# EasyEDA Pro project UARTAI.eprj

# Schematic UARTAI

## Sheets
1 Power: Create Date: 2025-04-27; Page Name: Power; Project Name: UARTAI; Schematic Name: UARTAI; Update Date: 2025-04-28; Company: geek-logic.com; Page Size: A4; Version: V1.0
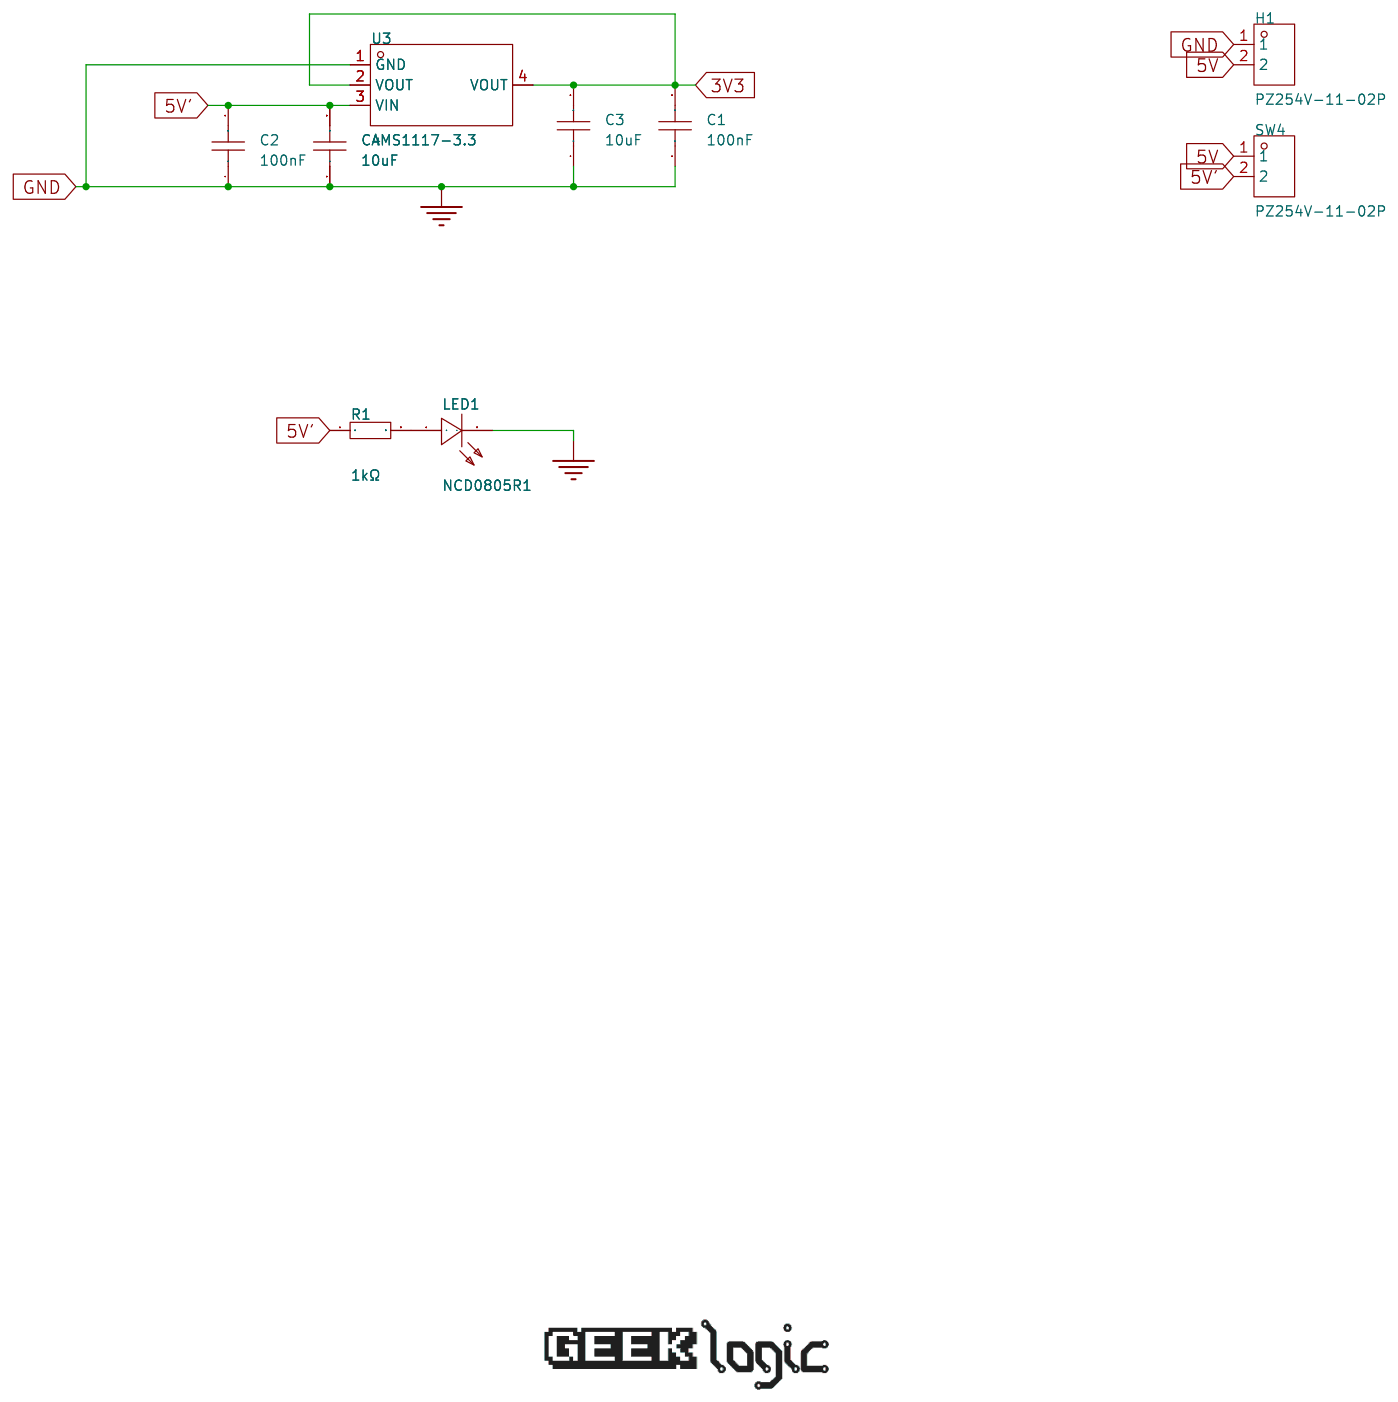
[diagram p0: Power]
2 MCU: Board Name: Board1; Page Name: MCU
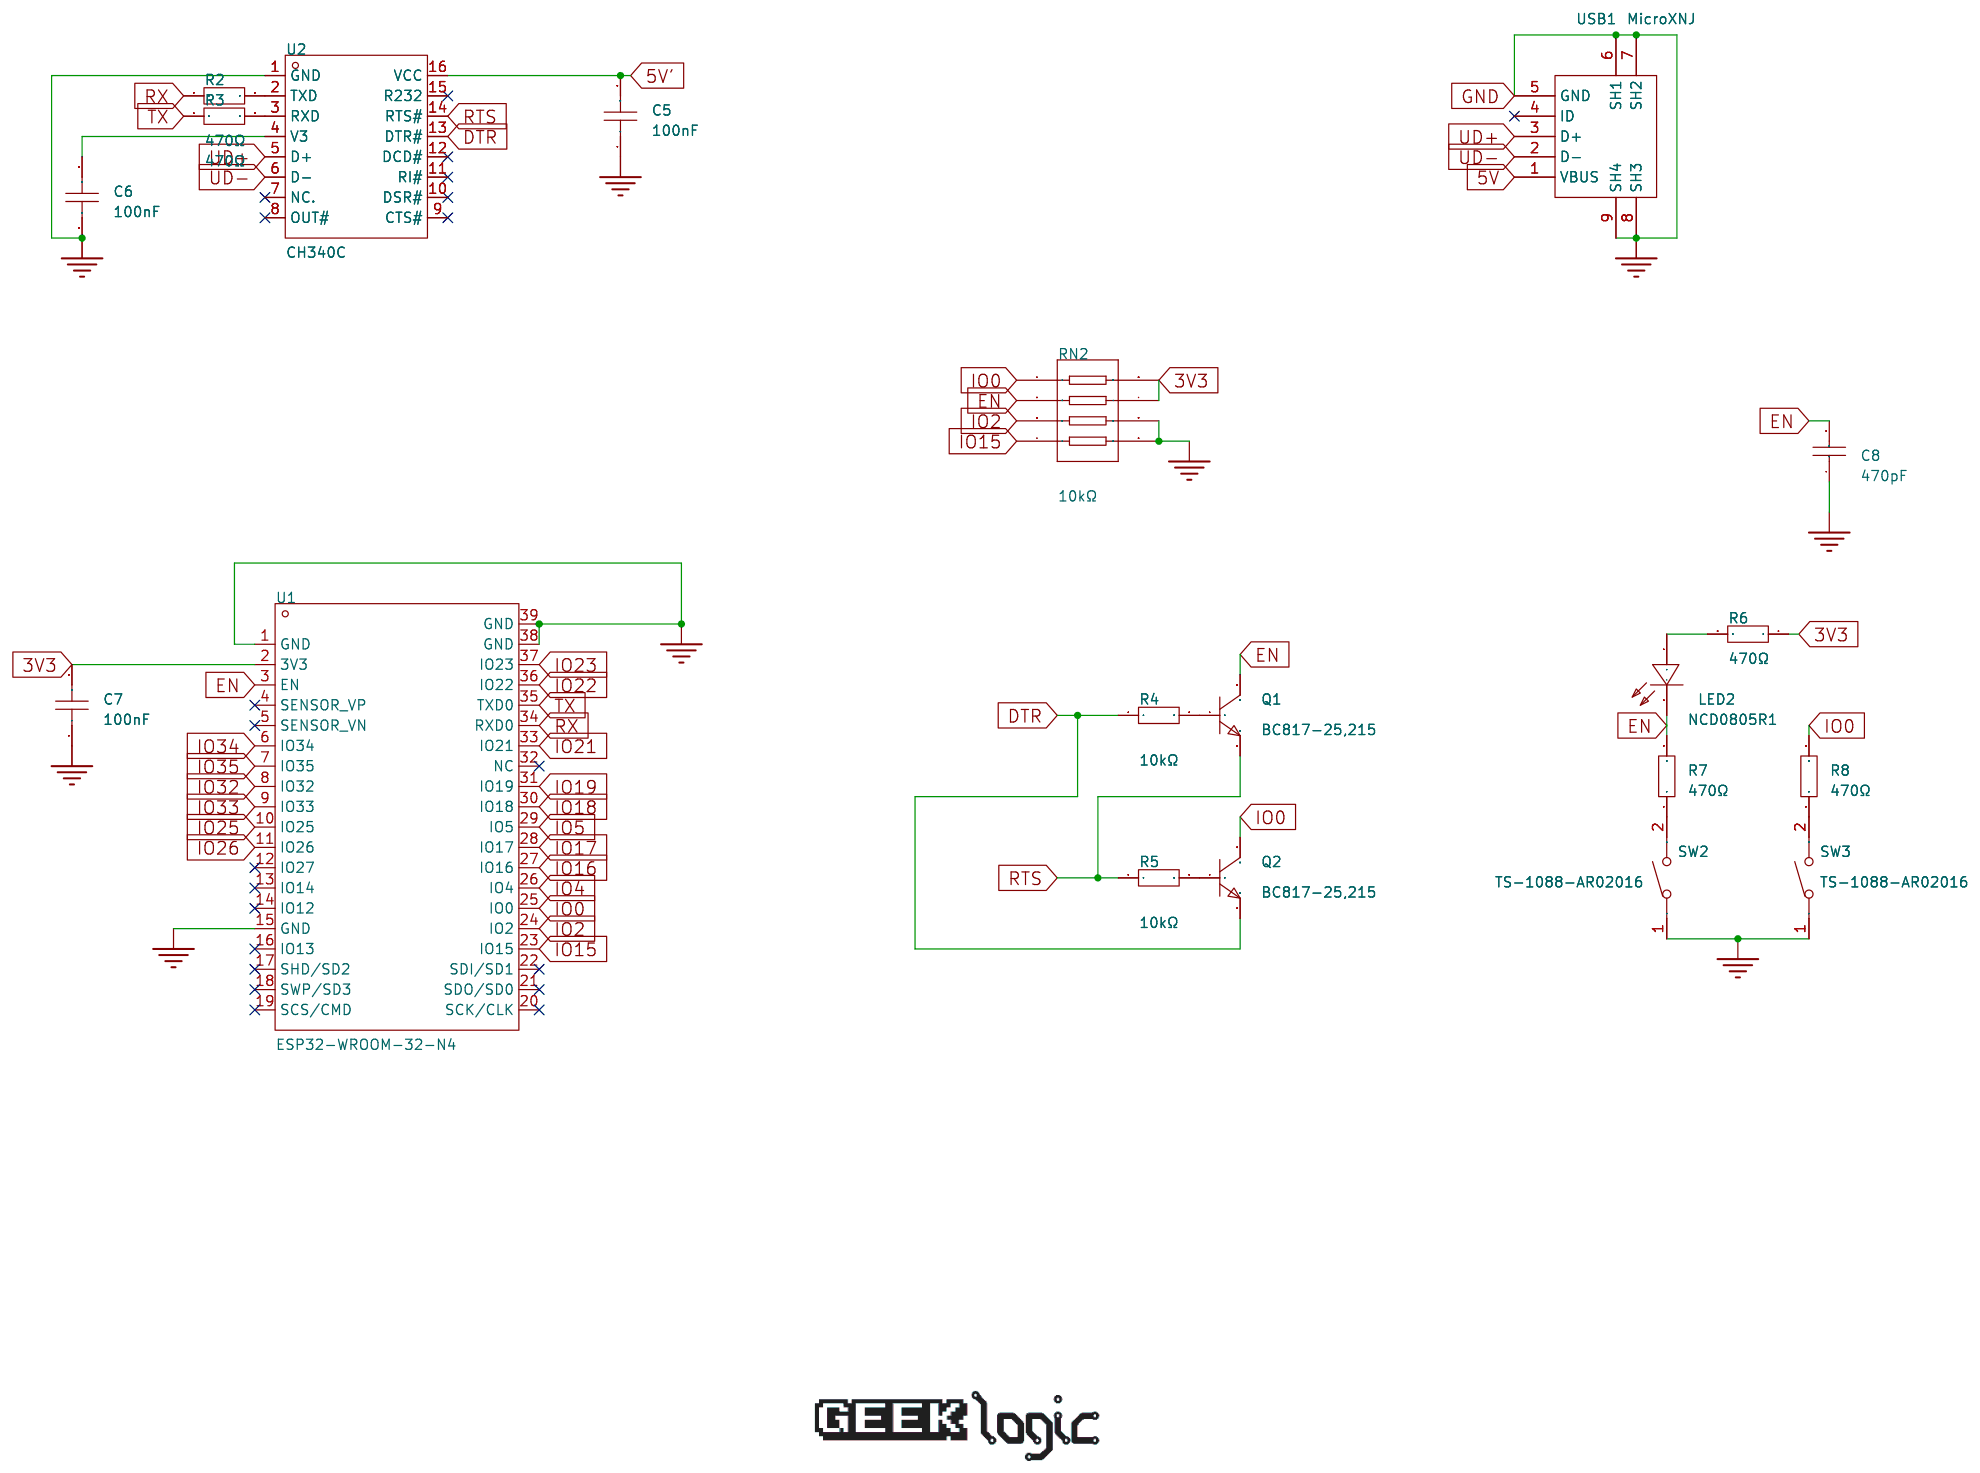
[diagram p1: MCU]
3 RS232: Board Name: Board1; Page Name: RS232; Company: 嘉立创EDA
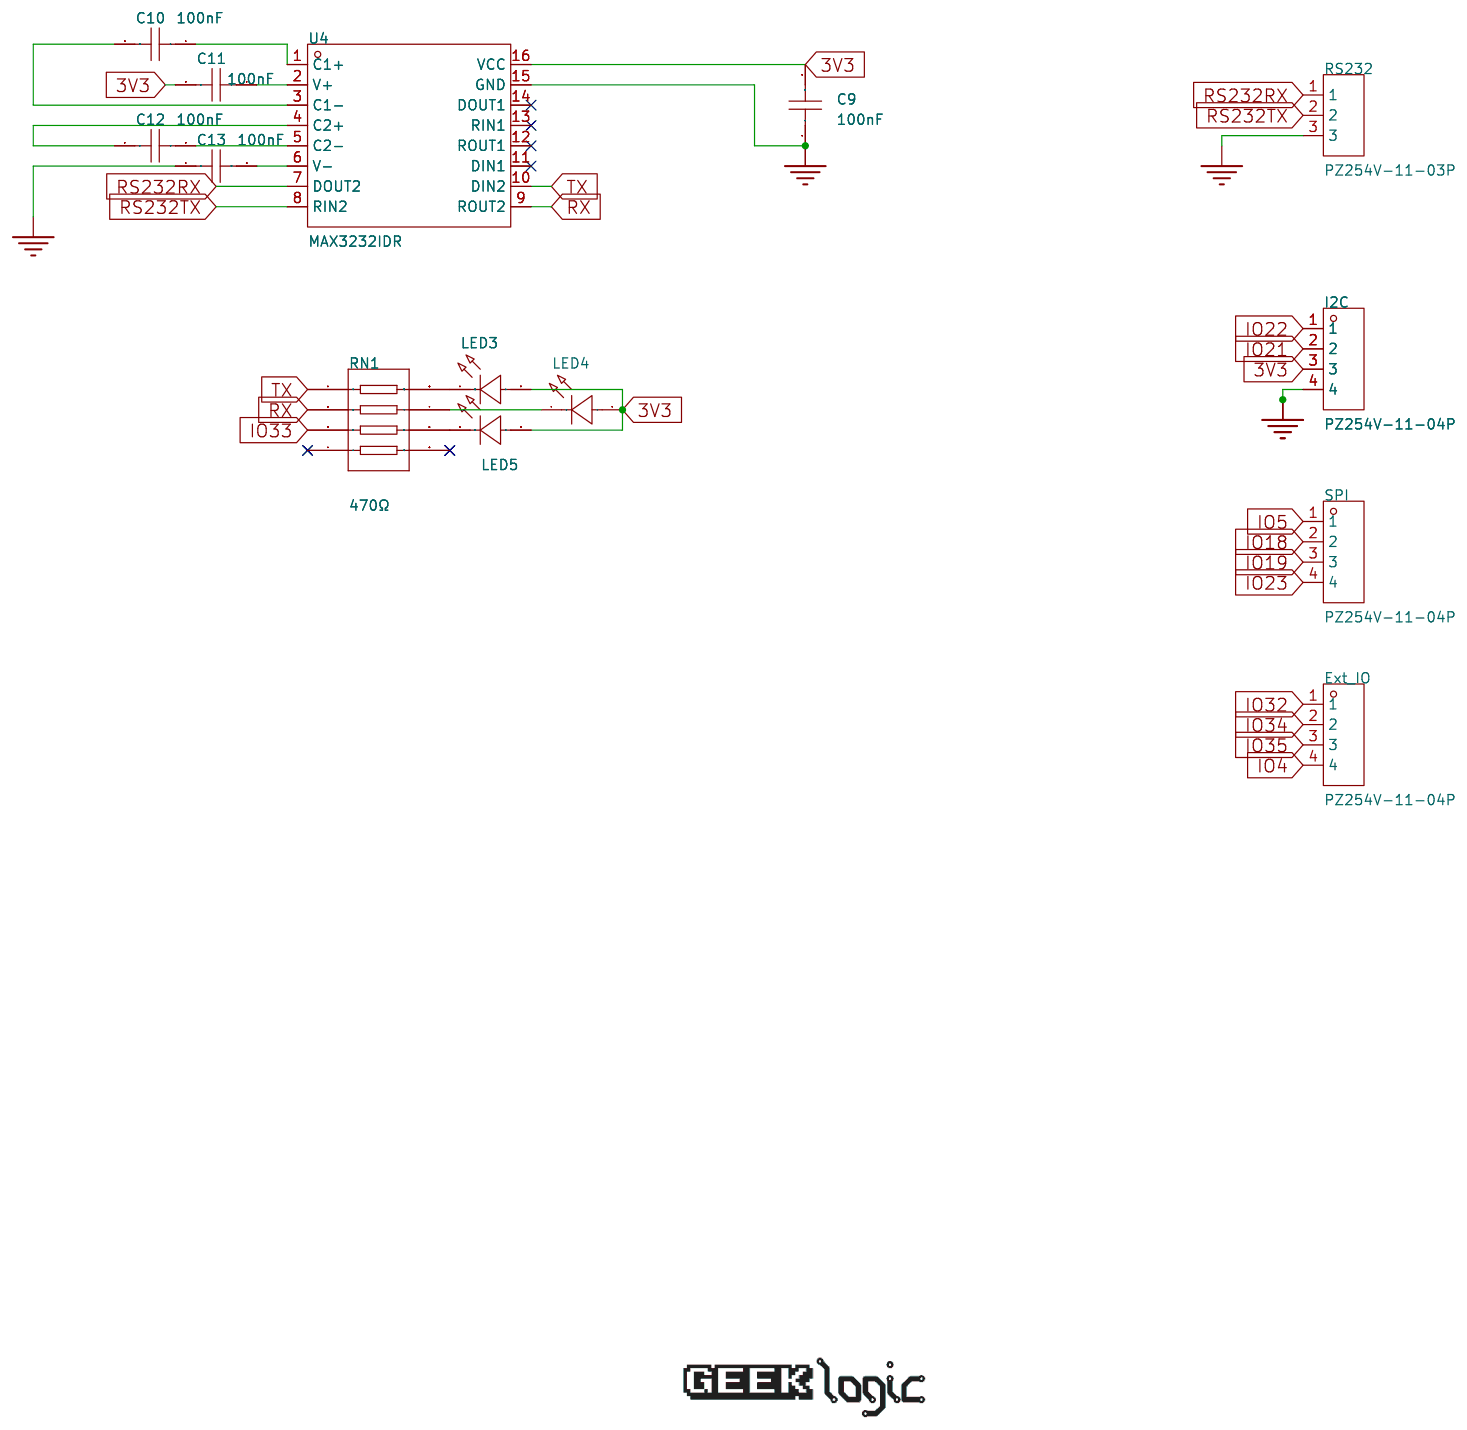
[diagram p2: RS232]

## Parts
sheet MCU
C5  100nF  [C0805]
C6  100nF  [C0805]
C7  100nF  [C0805]
C8  470pF  [C0805]
LED2  NCD0805R1  [LED0805-R-RD]
Q1  BC817-25,215  [SOT-23-3_L2.9-W1.6-P1.90-LS2.8-BR]
Q2  BC817-25,215  [SOT-23-3_L2.9-W1.6-P1.90-LS2.8-BR]
R2  470Ω  [R0805]
R3  470Ω  [R0805]
R4  10kΩ  [R0805]
R5  10kΩ  [R0805]
R6  470Ω  [R0805]
R7  470Ω  [R0805]
R8  470Ω  [R0805]
RN2  10kΩ  [RES-ARRAY-SMD_0603-8P-L3.2-W1.6-BL]
SW2  TS-1088-AR02016  [SW-SMD_L3.9-W3.0-P4.45]
SW3  TS-1088-AR02016  [SW-SMD_L3.9-W3.0-P4.45]
U1  ESP32-WROOM-32-N4  [WIFIM-SMD_ESP32-WROOM-32-N4]
U2  CH340C  [SOP-16_L10.0-W3.9-P1.27-LS6.0-BL]
USB1  MicroXNJ  [MICRO-USB-SMD_MICROXNJ]
sheet Power
C1  100nF  [C0805]
C2  100nF  [C0805]
C3  10uF  [C0805]
C4  10uF  [C0805]
H1  PZ254V-11-02P  [HDR-TH_2P-P2.54-V-M]
LED1  NCD0805R1  [LED0805-R-RD]
R1  1kΩ  [R0805]
SW4  PZ254V-11-02P  [HDR-TH_2P-P2.54-V-M]
U3  AMS1117-3.3  [SOT-223-3_L6.5-W3.4-P2.30-LS7.0-BR]
sheet RS232
C9  100nF  [C0805]
C10  100nF  [C0805]
C11  100nF  [C0805]
C12  100nF  [C0805]
C13  100nF  [C0805]
Ext_IO  PZ254V-11-04P  [HDR-TH_4P-P2.54-V-M]
I2C  PZ254V-11-04P  [HDR-TH_4P-P2.54-V-M]
LED3  SLR-342MG3F  [LED-TH_BD3.8-P2.54-RD]
LED4  SLR-342MG3F  [LED-TH_BD3.8-P2.54-RD]
LED5  SLR-342MG3F  [LED-TH_BD3.8-P2.54-RD]
RN1  470Ω  [RES-ARRAY-SMD_0603-8P-L3.2-W1.6-BL]
RS232  PZ254V-11-03P  [HDR-TH_3P-P2.54-V-M]
SPI  PZ254V-11-04P  [HDR-TH_4P-P2.54-V-M]
U4  MAX3232IDR  [SOIC-16_L9.9-W3.9-P1.27-LS6.0-BL]

## Library data of the parts
C1 C2 C5-C7 = CC0805KRX7R9BB104: LCSC Part Name: 100nF ±10% 50V; Supplier Part: C49678; Manufacturer: YAGEO(国巨); Supplier Footprint: 0805; JLCPCB Part Class: 基础库; Datasheet: https://atta.szlcsc.com/upload/public/pdf/source/20180224/C181747_15194369449651363981.pdf; Supplier: LCSC; Tolerance: ±10%; Voltage Rated: 50V; Temperature Coefficient: X7R; Check: true
C8 = 0805B471K500NT: 容值:470pF;精度:±10%;额定电压:50V;材质(温度系数):X7R;; LCSC Part Name: 470pF ±10% 50V; Supplier Part: C1743; Manufacturer: FH(风华); Supplier Footprint: 0805; JLCPCB Part Class: 基础库; Datasheet: https://atta.szlcsc.com/upload/public/pdf/source/20200305/C486355_26A10D38EF8C2A5C37091D0039909270.pdf; Supplier: LCSC; Tolerance: ±10%; Voltage Rated: 50V; Temperature Coefficient: X7R; Check: true
LED1 LED2 = NCD0805R1: Supplier Part: C84256; Manufacturer: 国星光电; Supplier Footprint: 0805; JLCPCB Part Class: 基础库; Datasheet: https://atta.szlcsc.com/upload/public/pdf/source/20200820/C84256_F0A75A43B3EAD75808600A0514C76B99.pdf; Supplier: LCSC; Emitted Color: 红色; Forward Voltage (VF): 1.6V~2.6V; Power Dissipation: 65mW; Forward Current: 20mA; Dominant Wavelength: 615nm~630nm; Diode Configuration: 独立二极管; Lens Color: 无色透明透镜; Luminous Intensity: 67mcd~195mcd; Viewing Angle: 130°; Operating Temperature: -30℃~+85℃; Check: true
Q1 Q2 = BC817-25,215: 晶体管类型:NPN;集电极电流(Ic):500mA;集射极击穿电压(Vceo):45V;功率(Pd):345mW;直流电流增益(hFE@Ic,Vce):160@100mA,1V;; LCSC Part Name: NPN 电流:500mA 耐压:45V hfe=160~400; Supplier Part: C39828; Manufacturer: Nexperia(安世); Supplier Footprint: SOT-23; JLCPCB Part Class: 扩展库; Datasheet: https://atta.szlcsc.com/upload/public/pdf/source/20230809/66EBCDF15581E5AD3889B2C47A4438C7.pdf; Supplier: LCSC; Transistor Type: NPN; Collector Current (Ic): 500mA; Collector-Emitter Breakdown Voltage (Vceo): 45V; Power Dissipation (Pd): 345mW; DC Current Gain (hFE@Ic,Vce): 160@100mA,1V; Transition Frequency (fT): 100MHz; Collector Cut-Off Current (Icbo): 100nA; Collector-Emitter Saturation Voltage (VCE(sat)@Ic,Ib): 700mV@500mA,50mA; Operating Temperature: -65℃~+150℃; Check: true
R2 R3 R6-R8 = 0805W8F4700T5E: 电阻类型:厚膜电阻;阻值:470Ω;精度:±1%;功率:125mW;最大工作电压:150V;温度系数:±100ppm/℃;; LCSC Part Name: 470Ω ±1% 125mW 厚膜电阻; Supplier Part: C17710; Manufacturer: UNI-ROYAL(厚声); Supplier Footprint: 0805; JLCPCB Part Class: 基础库; Datasheet: https://atta.szlcsc.com/upload/public/pdf/source/20200306/C422600_1E6D84923E4A46A82E41ADD87F860B5C.pdf; Supplier: LCSC; Type: 厚膜电阻; Tolerance: ±1%; Power(Watts): 125mW; Overload Voltage (Max): 150V; Temperature Coefficient: ±100ppm/℃; Operating Temperature Range: -55℃~+155℃; Check: true
R4 R5 = 0805W8F1002T5E_C17414: LCSC Part Name: 10kΩ ±1% 125mW 厚膜电阻; Supplier Part: C17414; Manufacturer: UNI-ROYAL(厚声); Manufacturer Part: 0805W8F1002T5E; Supplier Footprint: 0805; JLCPCB Part Class: 基础库; Datasheet: https://atta.szlcsc.com/upload/public/pdf/source/20200306/C422600_1E6D84923E4A46A82E41ADD87F860B5C.pdf; Supplier: LCSC; Type: 厚膜电阻; Tolerance: ±1%; Power(Watts): 125mW; Overload Voltage (Max): 150V; Temperature Coefficient: ±100ppm/℃; Operating Temperature Range: -55℃~+155℃; Check: true
RN2 = 4D03WGJ0103T5E: LCSC Part Name: 10kΩ ±5%; Supplier Part: C29718; Manufacturer: UNI-ROYAL(厚声); Supplier Footprint: 0603x4; JLCPCB Part Class: 基础库; Datasheet: https://atta.szlcsc.com/upload/public/pdf/source/20191224/C474318_2527498AE30E813171187CCD28401A71.pdf; Supplier: LCSC; Number of Resistors: 4; Tolerance: ±5%; Power(Watts): 62.5mW; Temperature Coefficient: ±200ppm/℃; Number of Pins: 8
SW2 SW3 = TS-1088-AR02016: 电路结构:单刀单掷;按钮形状:圆形按钮;作用力:160gf;安装方式:立贴;开关长度:4mm;开关宽度:3mm;开关高度:2mm;带支架:不带;触点电流:50mA;额定电压(DC):12V;绝缘电阻:100MΩ;机械寿命:10万次;; LCSC Part Name: 4*3*2mm 立贴 轻触开关; Supplier Part: C720477; Manufacturer: XUNPU(讯普); Supplier Footprint: SMD; JLCPCB Part Class: 扩展库; Datasheet: https://atta.szlcsc.com/upload/public/pdf/source/20200810/C720475_60D09DD6C54279ADDB2DC25100F1CC11.pdf; Supplier: LCSC; Circuit: 单刀单掷; Actuator Style: 圆形按钮; Operating Force: 160gf; Mounting Style: 立贴; Switch Length: 4mm; Switch Width: 3mm; Switch Height: 2mm; Strike Gundam: 不带; Contact Current: 50mA; Voltage Rating (DC): 12V; Insulation Resistance: 100MΩ; Actuator/Cap Color: 黑色; Pin Style: SMD接片; Mechanical Life: 10万次; Operating Temperature: -30℃~+80℃; Check: true
U1 = ESP32-WROOM-32-N4: WiFi+蓝牙4.2+双核CPU,ESP32; LCSC Part Name: WiFi+蓝牙4.2+双核CPU模块; Supplier Part: C82899; Manufacturer: ESPRESSIF(乐鑫); Supplier Footprint: SMD,18x25.5mm; JLCPCB Part Class: 扩展库; Datasheet: https://atta.szlcsc.com/upload/public/pdf/source/20210719/C82899_2D52724B6FAFABC419BCF308C5944296.pdf; Supplier: LCSC; Check: true
U2 = CH340C: 应用功能:收发器;接口协议:USB 2.0;数据速率:2Mbps;; LCSC Part Name: CH340C USB转串口芯片 CH340; Supplier Part: C84681; Manufacturer: WCH(南京沁恒); Supplier Footprint: SOP-16; JLCPCB Part Class: 扩展库; Datasheet: https://atta.szlcsc.com/upload/public/pdf/source/20240619/63986D8440D4E5267A77ACD891CC4DE3.pdf; Supplier: LCSC; Applications Function: 收发器; Protocol: USB 2.0; Supply Voltage: 3.3V；5V; Data Rate: 2Mbps; Check: true
USB1 = MicroXNJ: 连接器类型:Micro-B;标准:USB 2.0;公母:母;安装方式:卧贴;触点数量:5P;端口数量:1;额定电流 - 电源:1.8A;工作温度范围:-20℃~+85℃;; LCSC Part Name: Micro-B 母 卧贴; Supplier Part: C404969; Manufacturer: SHOU HAN(首韩); Supplier Footprint: SMD; JLCPCB Part Class: 扩展库; Datasheet: https://atta.szlcsc.com/upload/public/pdf/source/20220415/2494EDFF499AF6F852F7C820374B6AF3.pdf; Supplier: LCSC; Connector Type: Micro-B; Standard: USB 2.0; Gender: 母; Mounting Style: 卧贴; Number of Contacts: 5P; Number of Ports: 1; Current Rating - Power (Max): 1.8A; Operating Temperature Range: -20℃~+85℃; Rated Voltage (Max): 30V; Connect-Disconnect Life: 5千次; Core Colour: 黑色; Check: true
C3 C4 = GRM21BR61H106KE43L: 容值:10uF;精度:±10%;额定电压:50V;材质(温度系数):X5R;; LCSC Part Name: 10uF ±10% 50V; Supplier Part: C440198; Manufacturer: muRata(村田); Supplier Footprint: 0805; JLCPCB Part Class: Basic Part; Datasheet: https://atta.szlcsc.com/upload/public/pdf/source/20230811/95AAE0C9AF55EDC31B7A4D8B733F534E.pdf; Supplier: LCSC; Tolerance: ±10%; Voltage Rated: 50V; Temperature Coefficient: X5R; Check: true
H1 SW4 = PZ254V-11-02P: LCSC Part Name: 1x2P 间距:2.54mm 方针 直插; Supplier Part: C492401; Manufacturer: XFCN(兴飞); Supplier Footprint: 插件,P=2.54mm; JLCPCB Part Class: 扩展库; Datasheet: https://atta.szlcsc.com/upload/public/pdf/source/20200309/C492401_A812433581A9B211A7FFA413ADDFF0E5.pdf; Supplier: LCSC; Pin Structure: 1x2P; Pitch: 2.54mm; Circluar Pins/Square Pins: 方针; Mounting Type: 直插; Number of Rows: 单排; Number of Pins: 2P; Length of Mating Pin: 6mm; Insulation Height: 2.5mm; Length of End Connection Pin: 3mm; Contact Material: 黄铜; Operating Temperature: -40℃~+105℃; Color: 黑色; Check: true
R1 = 0805W8F1001T5E: LCSC Part Name: 1kΩ ±1% 125mW 厚膜电阻; Supplier Part: C17513; Manufacturer: UNI-ROYAL(厚声); Supplier Footprint: 0805; JLCPCB Part Class: 基础库; Datasheet: https://atta.szlcsc.com/upload/public/pdf/source/20200306/C422600_1E6D84923E4A46A82E41ADD87F860B5C.pdf; Supplier: LCSC; Type: 厚膜电阻; Tolerance: ±1%; Power(Watts): 125mW; Overload Voltage (Max): 150V; Temperature Coefficient: ±100ppm/℃; Operating Temperature Range: -55℃~+155℃; Check: true
U3 = AMS1117-3.3_C6186: 输出类型:固定;最大输入电压:-;输出电压:3.3V;最大输出电流:1A;电源纹波抑制比(PSRR):72dB@(120Hz);输出极性:正极;; LCSC Part Name: 输出3.3V 1A; Supplier Part: C6186; Manufacturer: AMS; Supplier Footprint: SOT-223; JLCPCB Part Class: 基础库; Datasheet: https://atta.szlcsc.com/upload/public/pdf/source/20180727/C6186_7A095716F0823C02F1997A905E26C086.pdf; Supplier: LCSC; Output Type: 固定; Output Voltage: 3.3V; MAX Output Current: 1A; Power Supply Rejection Ratio (PSRR): 72dB@(120Hz); Dropout Voltage: 1.3V@(800mA); Output Polarity: 正极; Number of Outputs: 1; Check: true
C9-C13 = CC0805KRX7R9BB104: LCSC Part Name: 100nF ±10% 50V; Supplier Part: C49678; Manufacturer: YAGEO(国巨); Supplier Footprint: 0805; JLCPCB Part Class: 基础库; Datasheet: https://atta.szlcsc.com/upload/public/pdf/source/20180224/C181747_15194369449651363981.pdf; Supplier: LCSC; Tolerance: ±10%; Voltage Rated: 50V; Temperature Coefficient: X7R
Ext_IO I2C SPI = PZ254V-11-04P: LCSC Part Name: 间距:2.54mm 1x4P 直插 方针; Supplier Part: C2691448; Manufacturer: XFCN(兴飞); Supplier Footprint: 插件,P=2.54mm; JLCPCB Part Class: 扩展库; Datasheet: https://atta.szlcsc.com/upload/public/pdf/source/20200309/C492403_F9F19131791D08044AD4F84F8E751A34.pdf; Supplier: LCSC; Pin Structure: 1x4P; Pitch: 2.54mm; Circluar Pins/Square Pins: 方针; Mounting Type: 直插; Number of Rows: 单排; Number of Pins: 4P; Current Rating (Max): 3A; Voltage Rating (Max): 250V; Length of Mating Pin: 6mm; Insulation Height: 2.5mm; Length of End Connection Pin: 3mm; Operating Temperature Range: -40℃~+105℃; Color: 黑色
LED3-LED5 = SLR-342MG3F: Supplier Part: C3014173; Manufacturer: ROHM(罗姆); Supplier Footprint: 插件,D=3.1mm; JLCPCB Part Class: 扩展库; Datasheet: https://atta.szlcsc.com/upload/public/pdf/source/20220606/1182B9E8607838122BB284BEC3B9B4B1.pdf; Supplier: LCSC; Lamp Holder Type: 3.1mm圆形灯头
RN1 = 4D03WGJ0471T5E: LCSC Part Name: 470Ω ±5%; Supplier Part: C25510; Manufacturer: UNI-ROYAL(厚声); Supplier Footprint: 0603x4; JLCPCB Part Class: 扩展库; Datasheet: https://atta.szlcsc.com/upload/public/pdf/source/20191224/C474318_2527498AE30E813171187CCD28401A71.pdf; Supplier: LCSC; Number of Resistors: 4; Tolerance: ±5%; Power(Watts): 62.5mW; Temperature Coefficient: ±200ppm/℃; Number of Pins: 8
RS232 = PZ254V-11-03P: LCSC Part Name: 1x3P 间距:2.54mm 方针 直插; Supplier Part: C2937625; Manufacturer: XFCN(兴飞); Supplier Footprint: 插件,P=2.54mm; JLCPCB Part Class: 扩展库; Datasheet: https://atta.szlcsc.com/upload/public/pdf/source/20200309/C492402_8335C3D49C4E4C618838D59BB1D024C1.pdf; Supplier: LCSC; Pin Structure: 1x3P; Pitch: 2.54mm; Circluar Pins/Square Pins: 方针; Mounting Type: 直插; Number of Rows: 单排; Number of Pins: 3P; Current Rating: 3A; Voltage Rating (Max): 250V; Length of Mating Pin: 6mm; Insulation Height: 2.5mm; Length of End Connection Pin: 3mm; Operating Temperature: -40℃~+105℃; Color: 黑色
U4 = MAX3232IDR: LCSC Part Name: MAX3232 3V至5.5V多通道RS-232线路驱动器/接收器，带±15-kV ESD保护; Supplier Part: C18261; Manufacturer: TI(德州仪器); Supplier Footprint: SOIC-16; JLCPCB Part Class: 扩展库; Supplier: LCSC; Types: 收发器; Number of Driver: 2; Number of receiver: 2; Data Rate: 250Kbps; Supply Voltage: 3V~5.5V; Operating Temperature: -40℃~+85℃

## Nets
3V3: C1.2 C3.2 C7.2 C9.2 C11.2 I2C.3 LED3.2(A) LED4.2(A) LED5.2(A) R6.1 RN2.7 RN2.8 U1.2(3V3) U3.2(VOUT) U3.4(VOUT) U4.16(VCC)
5V: H1.2 SW4.1 USB1.1(VBUS)
5V': C2.2 C4.2 C5.2 R1.1 SW4.2 U2.16(VCC) U3.3(VIN)
GND: C1.1 C2.1 C3.1 C4.1 C5.1 C6.1 C7.1 C8.1 C9.1 C13.1 H1.1 I2C.4 LED1.2(-) RN2.5 RN2.6 RS232.3 SW2.1 SW3.1 U1.1(GND) U1.15(GND) U1.38(GND) U1.39(GND) U2.1(GND) U3.1(GND) U4.15(GND) USB1.5(GND) USB1.6(SH1) USB1.7(SH2) USB1.8(SH3) USB1.9(SH4)
DTR: Q2.2 R4.1 U2.13(DTR#)
EN: C8.2 LED2.2(-) Q1.3 R7.2 RN2.2 U1.3(EN)
IO0: Q2.3 R8.2 RN2.1 U1.25(IO0)
IO2: RN2.3 U1.24(IO2)
IO4: Ext_IO.4 U1.26(IO4)
IO5: SPI.1 U1.29(IO5)
IO15: RN2.4 U1.23(IO15)
IO16: U1.27(IO16)
IO17: U1.28(IO17)
IO18: SPI.2 U1.30(IO18)
IO19: SPI.3 U1.31(IO19)
IO21: I2C.2 U1.33(IO21)
IO22: I2C.1 U1.36(IO22)
IO23: SPI.4 U1.37(IO23)
IO25: U1.10(IO25)
IO26: U1.11(IO26)
IO32: Ext_IO.1 U1.8(IO32)
IO33: RN1.3 U1.9(IO33)
IO34: Ext_IO.2 U1.6(IO34)
IO35: Ext_IO.3 U1.7(IO35)
RS232RX: RS232.1 U4.7(DOUT2)
RS232TX: RS232.2 U4.8(RIN2)
RTS: Q1.2 R5.1 U2.14(RTS#)
RX: R2.1 RN1.2 U1.34(RXD0) U4.9(ROUT2)
TX: R3.1 RN1.1 U1.35(TXD0) U4.10(DIN2)
UD+: U2.5(D+) USB1.3(D+)
UD-: U2.6(D-) USB1.2(D-)
$2N1178: LED1.1(+) R1.2
$3N709: R2.2 U2.2(TXD)
$3N711: R3.2 U2.3(RXD)
$3N768: C6.2 U2.4(V3)
$3N1856: Q2.1 R5.2
$3N1858: Q1.1 R4.2
$3N2241: R7.1 SW2.2
$3N2288: R8.1 SW3.2
$3N2506: LED2.1(+) R6.2
$4N599: C11.1 U4.2(V+)
$4N645: C10.1 U4.1(C1+)
$4N660: C10.2 U4.3(C1-)
$4N666: C12.1 U4.4(C2+)
$4N671: C12.2 U4.5(C2-)
$4N685: C13.2 U4.6(V-)
$4N1573: LED3.1(C) RN1.8
$4N1575: LED5.1(C) RN1.6
$4N1579: LED4.1(C) RN1.7

Not connected (* = marked no-connect by the designer): RN1 4* 5*; U1 4(SENSOR_VP)* 5(SENSOR_VN)* 12(IO27)* 13(IO14)* 14(IO12)* 16(IO13)* 17(SHD/SD2)* 18(SWP/SD3)* 19(SCS/CMD)* 20(SCK/CLK)* 21(SDO/SD0)* 22(SDI/SD1)* 32(NC)*; U2 7(NC.)* 8(OUT#)* 9(CTS#)* 10(DSR#)* 11(RI#)* 12(DCD#)* 15(R232)*; U4 11(DIN1)* 12(ROUT1)* 13(RIN1)* 14(DOUT1)*; USB1 4(ID)*

# Board UARTAI
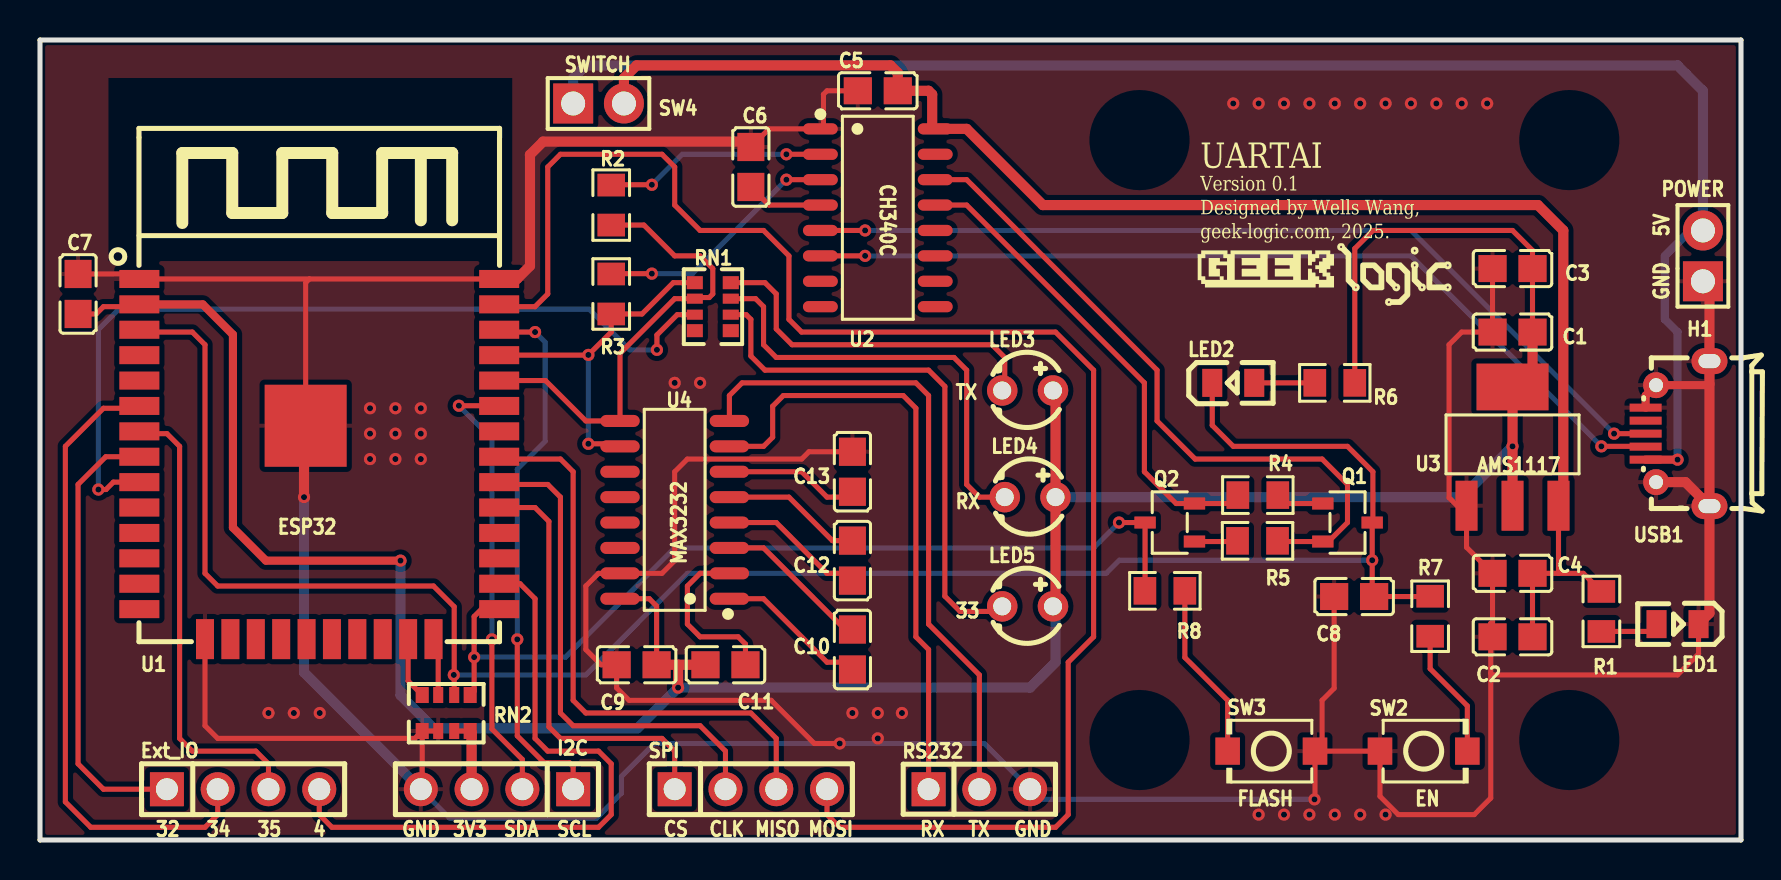
[diagram p3: board, top side]
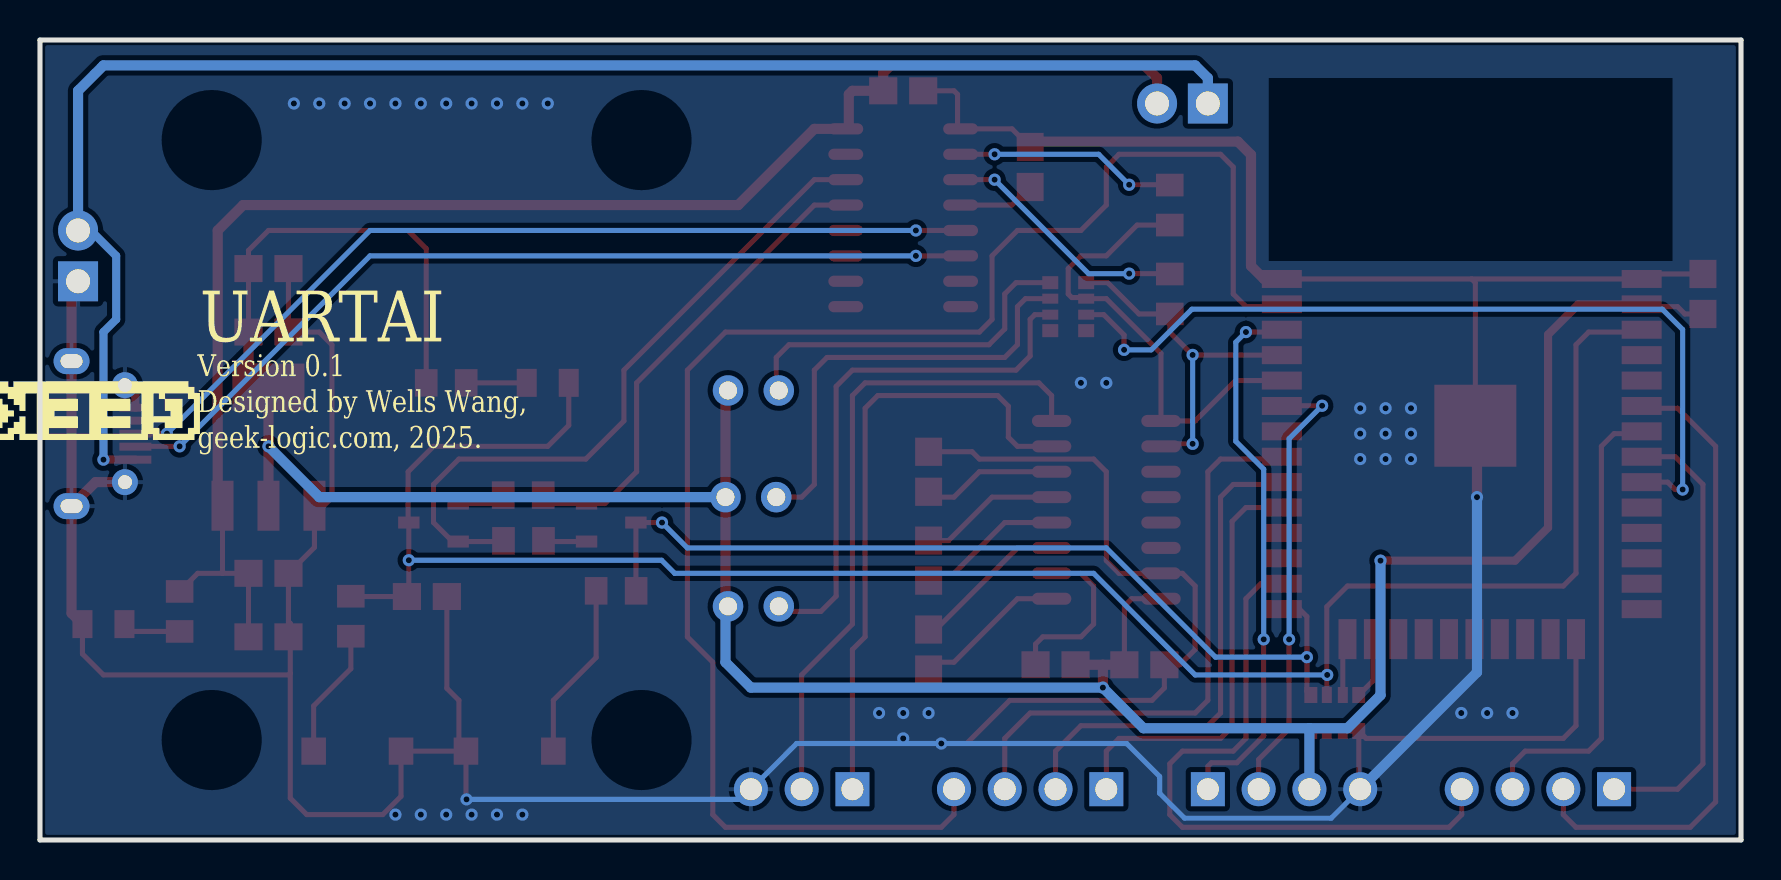
[diagram p4: board, bottom side, seen from below]

Outline 85.09 x 40 mm; copper layers: Top Layer, Bottom Layer. Coordinates in mm from the lower left corner of the outline.
Outline path: 0,40 85.09,40 85.09,0 0,0 0,40
Stack: Top Layer 0.035mm / Dielectric1 1.51mm FR4 er 4.5 / Bottom Layer 0.035mm

## Design rules (mm)
template: JLCPCB Capability(Two Layers Board)
spacing copperThickness1oz (default): track to track 0.102, other pairs 0.152 to 0.3
spacing copperThickness2oz: track to track 0.203, other pairs 0.152 to 0.3
track width copperThickness1oz (default): min 0.127, default 0.254, max 2.54
track width copperThickness2oz: min 0.203, default 0.254, max 2.54
differential pair differentialPair (default): width min 0.127, default 0.254, max 2.54; gap min 0.152, default 0.152
via viaSize (default): diameter min 0.5, default 0.61, max 10; hole min 0.3, default 0.305, max 6.3

## Placement (name value [footprint] x y rotation side)
C1  100nF  [C0805]  73.66 25.4 0 top
C2  100nF  [C0805]  73.66 10.16 0 top
C3  10uF  [C0805]  73.66 28.58 0 top
C4  10uF  [C0805]  73.66 13.33 0 top
C5  100nF  [C0805]  41.91 37.47 0 top
C6  100nF  [C0805]  35.56 33.66 270 top
C7  100nF  [C0805]  1.91 27.31 270 top
C8  470pF  [C0805]  65.74 12.17 0 top
C9  100nF  [C0805]  29.84 8.76 0 top
C10  100nF  [C0805]  40.64 9.53 90 top
C11  100nF  [C0805]  34.29 8.76 180 top
C12  100nF  [C0805]  40.64 13.97 90 top
C13  100nF  [C0805]  40.64 18.42 270 top
Ext_IO  PZ254V-11-04P  [HDR-TH_4P-P2.54-V-M]  10.16 2.54 0 top
H1  PZ254V-11-02P  [HDR-TH_2P-P2.54-V-M]  83.19 29.21 90 top
I2C  PZ254V-11-04P  [HDR-TH_4P-P2.54-V-M]  22.86 2.54 180 top
LED1  NCD0805R1  [LED0805-R-RD]  81.91 10.8 180 top
LED2  NCD0805R1  [LED0805-R-RD]  59.69 22.86 0 top
LED3  SLR-342MG3F  [LED-TH_BD3.8-P2.54-RD]  49.4 22.48 0 top
LED4  SLR-342MG3F  [LED-TH_BD3.8-P2.54-RD]  49.53 17.14 0 top
LED5  SLR-342MG3F  [LED-TH_BD3.8-P2.54-RD]  49.4 11.68 0 top
Q1  BC817-25,215  [SOT-23-3_L2.9-W1.6-P1.90-LS2.8-BR]  65.41 15.88 180 top
Q2  BC817-25,215  [SOT-23-3_L2.9-W1.6-P1.90-LS2.8-BR]  56.51 15.88 0 top
R1  1kΩ  [R0805]  78.1 11.43 270 top
R2  470Ω  [R0805]  28.57 31.75 90 top
R3  470Ω  [R0805]  28.57 27.31 90 top
R4  10kΩ  [R0805]  60.92 17.25 0 top
R5  10kΩ  [R0805]  60.91 14.96 180 top
R6  470Ω  [R0805]  64.77 22.86 180 top
R7  470Ω  [R0805]  69.54 11.19 90 top
R8  470Ω  [R0805]  56.27 12.46 180 top
RN1  470Ω  [RES-ARRAY-SMD_0603-8P-L3.2-W1.6-BL]  33.66 26.67 270 top
RN2  10kΩ  [RES-ARRAY-SMD_0603-8P-L3.2-W1.6-BL]  20.32 6.35 180 top
RS232  PZ254V-11-03P  [HDR-TH_3P-P2.54-V-M]  46.99 2.54 0 top
SPI  PZ254V-11-04P  [HDR-TH_4P-P2.54-V-M]  35.56 2.54 0 top
SW2  TS-1088-AR02016  [SW-SMD_L3.9-W3.0-P4.45]  69.22 4.44 0 top
SW3  TS-1088-AR02016  [SW-SMD_L3.9-W3.0-P4.45]  61.59 4.44 180 top
SW4  PZ254V-11-02P  [HDR-TH_2P-P2.54-V-M]  27.94 36.83 0 top
U1  ESP32-WROOM-32-N4  [WIFIM-SMD_ESP32-WROOM-32-N4]  13.97 19.05 0 top
U2  CH340C  [SOP-16_L10.0-W3.9-P1.27-LS6.0-BL]  41.91 31.11 270 top
U3  AMS1117-3.3  [SOT-223-3_L6.5-W3.4-P2.30-LS7.0-BR]  73.66 19.69 270 top
U4  MAX3232IDR  [SOIC-16_L9.9-W3.9-P1.27-LS6.0-BL]  31.75 16.51 90 top
USB1  MicroXNJ  [MICRO-USB-SMD_MICROXNJ]  81.91 20.32 90 top

## Footprints (pads in the part's own frame, mm; a bottom-side part is the same pattern mirrored in y, then rotated)
C0805
  rect 1.41x1.35 smd: 1(-1,0) 2(1,0)
HDR-TH_2P-P2.54-V-M
  rect 2x2 hole 1.2: 1(-1.27,0)
  round 2 hole 1.2: 2(1.27,0)
HDR-TH_3P-P2.54-V-M
  rect 1.7x1.7 hole 1.1: 1(-2.54,0)
  round 1.7 hole 1.1: 2(0,0) 3(2.54,0)
HDR-TH_4P-P2.54-V-M
  rect 1.7x1.7 hole 1.1: 1(-3.81,0)
  round 1.7 hole 1.1: 2(-1.27,0) 3(1.27,0) 4(3.81,0)
LED0805-R-RD
  rect 1x1.399 smd: 1(1.05,0) 2(-1.05,0)
LED-TH_BD3.8-P2.54-RD
  round 1.524 hole 0.9: 1(-1.27,0) 2(1.27,0)
MICRO-USB-SMD_MICROXNJ
  rect 0.4x1.6 smd: 1(-1.3,1.597) 2(-0.65,1.597) 3(0,1.597) 4(0.65,1.597) 5(1.3,1.597)
  round 1.3 hole 0.7: 6(2.425,1.074) 9(-2.425,1.073)
  oval 1.3x1.8 hole 0.7x1.1: 7(3.625,-1.597) 8(-3.625,-1.597)
R0805
  rect 1.133x1.377 smd: 1(-1,0) 2(1,0)
RES-ARRAY-SMD_0603-8P-L3.2-W1.6-BL
  rect 0.65x0.8 smd: 1(-1.2,-0.9) 4(1.2,-0.9) 5(1.2,0.9) 8(-1.2,0.9)
  rect 0.5x0.8 smd: 2(-0.4,-0.9) 3(0.4,-0.9) 6(0.4,0.9) 7(-0.4,0.9)
SOIC-16_L9.9-W3.9-P1.27-LS6.0-BL
  oval 0.602x1.971 smd: 1(-4.445,-2.736) 2(-3.175,-2.736) 3(-1.905,-2.736) 4(-0.635,-2.736) 5(0.635,-2.736) 6(1.905,-2.736) 7(3.175,-2.736) 8(4.445,-2.736) 9(4.445,2.736) 10(3.175,2.736) 11(1.905,2.736) 12(0.635,2.736) 13(-0.635,2.736) 14(-1.905,2.736) 15(-3.175,2.736) 16(-4.445,2.736)
SOP-16_L10.0-W3.9-P1.27-LS6.0-BL
  oval 0.56x1.745 smd: 1(-4.445,-2.873) 2(-3.175,-2.873) 3(-1.905,-2.873) 4(-0.635,-2.873) 5(0.635,-2.873) 6(1.905,-2.873) 7(3.175,-2.873) 8(4.445,-2.873) 9(4.445,2.873) 10(3.175,2.873) 11(1.905,2.873) 12(0.635,2.873) 13(-0.635,2.873) 14(-1.905,2.873) 15(-3.175,2.873) 16(-4.445,2.873)
SOT-23-3_L2.9-W1.6-P1.90-LS2.8-BR
  rect 1.07x0.6 smd: 1(1.235,-0.95) 2(1.235,0.95) 3(-1.235,0)
SOT-223-3_L6.5-W3.4-P2.30-LS7.0-BR
  rect 2.5x1.1 smd: 1(2.97,-2.3) 2(2.97,0) 3(2.97,2.3)
  rect 2.34x3.6 smd: 4(-2.97,0)
SW-SMD_L3.9-W3.0-P4.45
  rect 1.23x1.36 smd: 1(-2.185,0) 2(2.185,0)
WIFIM-SMD_ESP32-WROOM-32-N4
  rect 2x0.9 smd: 1(-9,9.005) 2(-9,7.735) 3(-9,6.465) 4(-9,5.195) 5(-9,3.925) 6(-9,2.655) 7(-9,1.385) 8(-9,0.115) 9(-9,-1.155) 10(-9,-2.425) 11(-9,-3.695) 12(-9,-4.965) 13(-9,-6.235) 14(-9,-7.505) 25(9,-7.505) 26(9,-6.235) 27(9,-4.965) 28(9,-3.695) 29(9,-2.425) 30(9,-1.155) 31(9,0.115) 32(9,1.385) 33(9,2.655) 34(9,3.925) 35(9,5.195) 36(9,6.465) 37(9,7.735) 38(9,9.005)
  rect 0.9x2 smd: 15(-5.715,-9.005) 16(-4.445,-9.005) 17(-3.175,-9.005) 18(-1.905,-9.005) 19(-0.635,-9.005) 20(0.635,-9.005) 21(1.905,-9.005) 22(3.175,-9.005) 23(4.445,-9.005) 24(5.715,-9.005)
  rect 4.1x4.1 smd: 39(-0.68,1.665)

## Nets
As in the schematic.

Pads without a net: RN1 4 5; U1 4 5 12 13 14 16 17 18 19 20 21 22 32; U2 7 8 9 10 11 12 15; U4 11 12 13 14; USB1 4

## Via types
v1: diameter 0.61, hole 0.305, Top Layer to Bottom Layer, 62 vias

## Routing (per net, layer and track width the routed paths; a pad name or vN(x,y) marks a point on that pad's centre or on a via; arc(x,y) is an arc through that point)
3V3: length 151.4
  Top Layer w0.254: RN2.8 RN2.7 ; C7.2 2.81,26.31 3.17,26.67 4.86,26.67 U1.2 ; C1.2 C3.2 74.66,29.48 73.66,30.48 66.68,30.48 65.77,29.58 R6.1 ; U4.16 30.48,12.06 30.84,11.7 C9.2
  Top Layer w0.406: v1(18.03,13.97) 11.3,13.97 9.65,15.62 9.65,25.27 8.14,26.78 U1.2
  Top Layer w0.508: LED3.2 50.8,22.35 LED4.2 50.8,11.81 LED5.2 ; U3.2 v1(73.66,19.69) U3.4 74.66,23.66 C1.2 ; I2C.3 21.59,5.38 RN2.8 ; 31.92,8.76 v1(31.92,7.62) ; 31.92,8.76 C11.2 ; 31.92,8.76 C9.2
  Bottom Layer w0.508: I2C.3 21.59,5.58 21.58,5.59 ; v1(18.03,13.97) 18.03,7.24 19.69,5.59 21.58,5.59 ; LED4.2 71.12,17.14 v1(73.66,19.69) ; 21.58,5.59 29.89,5.59 v1(31.92,7.62) 49.53,7.62 50.8,8.89 50.8,11.56 LED5.2
5V: length 80
  Top Layer w0.406: USB1.1 v1(81.91,19.02)
  Bottom Layer w0.406: H1.2 82.55,30.48 81.28,29.21 81.28,26.03 81.91,25.4 v1(81.91,19.02)
  Bottom Layer w0.508: H1.2 83.19,37.47 81.91,38.73 27.31,38.73 26.67,38.1 SW4.1
5V': length 77.6
  Top Layer w0.254: C2.2 C4.2 75.96,13.33 ; R1.1 77.2,13.33 75.96,13.33 ; 42.91,37.71 C5.2 ; 44.63,35.71 U2.16 ; 75.96,13.34 U3.3 76.2,16.95
  Top Layer w0.508: 44.63,35.71 44.63,37.29 44.45,37.47 C5.2 ; 42.91,37.71 42.91,38.37 42.54,38.73 29.84,38.73 29.21,38.1 SW4.2 ; U2.16 46.35,35.56 50.16,31.75 74.93,31.75 76.2,30.48 76.2,16.95
GND: length 270.4
  Top Layer w0.254: 13.48,28.06 4.97,28.06 4.72,28.31 C7.1 ; 13.48,28.06 13.29,27.87 U1.39 ; 13.48,28.06 22.97,28.06 ; C8.1 64.74,7.59 64.13,6.98 64.13,4.8 SW3.1 ; U1.15 8.25,5.72 8.89,5.08 18.75,5.08 RN2.5 ; C3.1 C1.1 71.12,25.4 70.49,24.77 70.49,17.12 71.36,16.24 ; v1(63.75,2.03) 63.78,2.06 SW3.1 ; RN2.5 19.12,2.61 I2C.4 ; RN2.5 RN2.6 ; SW3.1 SW2.1 67.03,2.19 67.94,1.27 71.75,1.27 72.57,2.09 72.57,8.34 ; 71.36,16.24 71.36,14.64 C4.1 72.66,10.92 ; 71.36,16.24 U3.1 ; 72.57,8.34 72.57,10.83 72.66,10.92 ; 72.57,8.34 72.66,8.25 81.91,8.25 82.97,9.31 LED1.2 ; 72.66,10.92 C2.1 ; C13.1 38.47,19.42 38.1,19.05 32.38,19.05 31.75,18.42 31.75,13.97 31.12,13.33 U4.15 27.94,13.33 27.31,12.7 27.31,9.53 28.07,8.76 C9.1 28.84,7.6 29.46,6.98 36.58,6.98 38.74,4.83 v1(40,4.83) ; C6.1 36.47,35.56 U2.1 39.19,35.71 39.19,37.29 39.37,37.47 C5.1
  Top Layer w0.406: 83.51,22.8 83.46,22.75 USB1.6 80.32,22.22 USB1.5
  Top Layer w0.508: USB1.9 82.31,17.89 USB1.8 ; 22.97,28.06 23.86,28.06 24.51,28.7 24.51,34.27 25.17,34.92 35.29,34.92 C6.1 ; USB1.8 USB1.7 83.51,27.61 H1.1 ; USB1.8 83.51,11.34 LED1.2 ; v1(13.21,17.14) 13.21,20.63 U1.39
  Bottom Layer w0.254: v1(63.75,2.03) 50.04,2.03 RS232.3 47.24,4.83 v1(40,4.83) 30.73,4.83 29.08,3.17 29.08,2.34 27.84,1.09 20.5,1.09 I2C.4
  Bottom Layer w0.508: v1(13.21,17.14) 13.21,8.38 I2C.4
  vias: v1(11.43,6.35) v1(12.7,6.35) v1(13.99,6.35) v1(16.51,21.59) v1(16.51,20.32) v1(16.51,19.05) v1(17.78,21.59) v1(17.78,20.32) v1(17.78,19.05) v1(19.05,21.59) v1(19.05,20.32) v1(19.05,19.05) v1(31.75,22.86) v1(33.02,22.86) v1(40.64,6.35) v1(41.91,6.35) v1(41.91,5.08) v1(43.12,6.35) v1(59.69,36.83) v1(60.96,36.83) v1(60.96,1.27) v1(62.23,36.83) v1(62.23,1.27) v1(63.5,36.83) v1(63.5,1.27) v1(64.77,36.83) v1(64.77,1.27) v1(66.04,36.83) v1(66.04,1.27) v1(67.31,36.83) v1(67.31,1.27) v1(68.58,36.83) v1(69.85,36.83) v1(71.12,36.83) v1(72.39,36.83)
DTR: length 24.1
  Top Layer w0.254: R4.1 59.5,16.83 Q2.2 56.84,16.83 55.25,18.42 55.25,22.86 46.35,31.75 U2.13
EN: length 101.2
  Top Layer w0.254: 20.72,8.28 20.72,11.67 19.69,12.7 8.89,12.7 8.25,13.33 8.25,24.77 7.62,25.4 5.08,25.4 U1.3 ; 20.72,8.28 20.7,8.26 v1(20.7,8.25) ; 20.72,8.28 RN2.2 ; LED2.2 58.64,20.74 59.69,19.69 65.41,19.69 66.68,18.42 66.68,15.91 Q1.3 v1(66.64,13.99) 66.64,12.27 C8.2 69.53,12.17 R7.2
  Bottom Layer w0.254: v1(66.64,13.99) 54,13.99 53.34,13.33 32.38,13.33 27.31,8.25 v1(20.7,8.25)
IO0: length 45.2
  Top Layer w0.254: v1(53.97,15.88) Q2.3 55.28,12.47 R8.2 ; U1.25 22.09,11.55 21.72,11.18 v1(21.72,9.14) 21.72,7.45 RN2.1
  Bottom Layer w0.254: v1(53.97,15.88) 52.71,14.61 31.75,14.61 26.29,9.14 v1(21.72,9.14)
IO2: length 2.9
  Top Layer w0.254: RN2.3 19.92,9.81 U1.24
IO4: length 32.4
  Top Layer w0.254: Ext_IO.4 13.97,1.27 14.61,0.63 27.94,0.63 28.57,1.27 28.57,3.81 27.94,4.44 25.4,4.44 24.76,5.08 24.76,12.06 24.01,12.81 U1.26
IO5: length 21.7
  Top Layer w0.254: U1.29 24.76,16.62 25.46,15.93 25.46,5.66 26.03,5.08 31.12,5.08 31.75,4.44 SPI.1
IO15: length 3.1
  Top Layer w0.254: RN2.4 18.41,7.95 U1.23
IO18: length 25.1
  Top Layer w0.254: SPI.2 34.29,4.44 33.02,5.72 26.67,5.72 26.03,6.35 26.03,17.14 25.4,17.78 23.09,17.78 U1.30
IO19: length 28.9
  Top Layer w0.254: SPI.3 36.83,5.08 35.56,6.35 27.31,6.35 26.67,6.98 26.67,18.42 26.03,19.05 23.09,19.05 U1.31
IO21: length 22.5
  Top Layer w0.254: I2C.2 24.13,4.03 22.61,5.55 v1(22.61,10.03) ; v1(20.96,21.72) 22.96,21.72 U1.33
  Bottom Layer w0.254: v1(20.96,21.72) 22.61,20.07 v1(22.61,10.03)
IO22: length 27.4
  Top Layer w0.254: U1.36 23.09,25.4 v1(24.76,25.4) ; I2C.1 26.67,3.68 26.49,3.86 25.22,3.86 23.88,5.21 v1(23.88,10.03)
  Bottom Layer w0.254: v1(23.88,10.03) 23.88,18.54 25.27,19.94 25.27,24.89 v1(24.76,25.4)
IO23: length 80.7
  Top Layer w0.254: SPI.4 39.37,1.27 40,0.63 50.8,0.63 51.44,1.27 51.44,8.89 52.71,10.16 52.71,23.5 50.8,25.4 38.1,25.4 37.47,26.03 37.47,29.21 36.19,30.48 33.02,30.48 31.75,31.75 31.75,33.66 31.12,34.29 26.03,34.29 25.4,33.66 25.4,27.31 24.76,26.67 23.09,26.67 U1.37
IO32: length 22.6
  Top Layer w0.254: Ext_IO.1 3.17,2.54 1.91,3.81 1.91,17.78 3.29,19.17 U1.8
IO33: length 42.5
  Top Layer w0.254: RN1.3 31.88,26.27 30.86,25.25 v1(30.86,24.51) ; v1(2.92,17.53) 3.3,17.53 3.67,17.89 U1.9
  Bottom Layer w0.254: v1(30.86,24.51) 29.5,24.51 27.47,26.54 3.94,26.54 2.92,25.53 v1(2.92,17.53)
IO34: length 32
  Top Layer w0.254: U1.6 4.86,21.59 3.17,21.59 1.27,19.69 1.27,1.91 2.54,0.63 8.25,0.63 8.89,1.27 Ext_IO.2
IO35: length 23.2
  Top Layer w0.254: U1.7 5.08,20.32 6.35,20.32 6.98,19.69 6.98,5.08 7.62,4.44 10.8,4.44 11.43,3.81 Ext_IO.3
RS232RX: length 30.9
  Top Layer w0.254: U4.7 36.19,19.69 36.65,20.14 36.65,21.69 37.18,22.22 43.18,22.22 43.81,21.59 43.81,10.16 44.45,9.53 RS232.1
RS232TX: length 32.5
  Top Layer w0.254: RS232.2 46.99,8.25 44.45,10.8 44.45,22.22 43.81,22.86 35.12,22.86 34.49,22.22 U4.8
RTS: length 34.2
  Top Layer w0.254: R5.1 61.94,14.92 Q1.2 64.46,14.92 65.41,15.88 65.41,17.78 64.13,19.05 57.78,19.05 55.88,20.95 55.88,23.5 46.35,33.02 U2.14
RX: length 23.4
  Top Layer w0.254: U1.34 25.28,22.97 27.31,20.95 U4.9 29.01,24.33 31.75,27.07 RN1.2 32.81,27.13 33.48,27.13 33.66,27.31 33.66,28.58 33.02,29.21 31.75,29.21 30.21,30.75 R2.1
TX: length 17.9
  Top Layer w0.254: RN1.1 31.68,27.87 30.12,26.31 R3.1 28.57,25.4 v1(27.43,24.26) 27.42,24.25 U1.35 ; U4.10 28.89,19.81 v1(27.43,19.81)
  Bottom Layer w0.254: v1(27.43,19.81) v1(27.43,24.26)
UD+: length 45.5
  Top Layer w0.254: USB1.3 v1(78.74,20.32) ; v1(41.28,30.48) U2.5
  Bottom Layer w0.254: v1(78.74,20.32) 68.58,30.48 v1(41.28,30.48)
UD-: length 45.2
  Top Layer w0.254: v1(78.1,19.69) 80.3,19.69 USB1.2 ; v1(41.28,29.21) U2.6
  Bottom Layer w0.254: v1(41.28,29.21) 68.58,29.21 v1(78.1,19.69)
$2N1178: length 2.9
  Top Layer w0.254: R1.2 80.5,10.43 LED1.1
$3N709: length 11.1
  Top Layer w0.254: R2.2 28.59,32.77 v1(30.61,32.77) ; U2.2 v1(37.34,34.29)
  Bottom Layer w0.254: v1(37.34,34.29) 32.13,34.29 v1(30.61,32.77)
$3N711: length 12.4
  Top Layer w0.254: U2.3 v1(37.34,33.02) ; v1(30.61,28.32) 28.59,28.32 R3.2
  Bottom Layer w0.254: v1(37.34,33.02) 32.64,28.32 v1(30.61,28.32)
$3N768: length 3.9
  Top Layer w0.254: C6.2 36.47,31.75 U2.4
$3N1856: length 2.2
  Top Layer w0.254: R5.2 59.87,14.92 Q2.1
$3N1858: length 2.4
  Top Layer w0.254: R4.2 62.34,16.83 Q1.1
$3N2241: length 6.5
  Top Layer w0.254: R7.1 69.54,8.56 71.4,6.7 SW2.2
$3N2288: length 8.9
  Top Layer w0.254: SW3.2 59.41,6.98 57.27,9.12 R8.1
$3N2506: length 3
  Top Layer w0.254: LED2.1 R6.2
$4N599: length 8.6
  Top Layer w0.254: U4.2 33.02,13.33 32.38,12.7 32.38,10.8 33.02,10.16 34.93,10.16 35.29,9.8 C11.1
$4N645: length 7.6
  Top Layer w0.254: U4.1 36.19,12.06 39.37,8.89 40.28,8.89 C10.1
$4N660: length 7.8
  Top Layer w0.254: C10.2 40.28,10.53 36.19,14.61 U4.3
$4N666: length 7.4
  Top Layer w0.254: C12.1 40.28,13.33 39.37,13.33 36.83,15.88 U4.4
$4N671: length 7.1
  Top Layer w0.254: C12.2 39.64,14.97 37.47,17.14 34.49,17.14
$4N685: length 6.8
  Top Layer w0.254: U4.6 38.1,18.42 39.37,17.14 40.37,17.14 C13.2
$4N1573: length 18
  Top Layer w0.254: RN1.8 36.26,27.87 36.83,27.31 36.83,25.56 37.62,24.77 47.62,24.77 48.26,24.13 48.26,22.61 LED3.1
$4N1575: length 27
  Top Layer w0.254: LED5.1 47.88,11.43 46.03,11.43 45.26,12.19 45.26,22.68 44.45,23.5 36.27,23.5 35.56,24.2 35.56,26.03 35.32,26.27 RN1.6
$4N1579: length 22.3
  Top Layer w0.254: LED4.1 46.99,17.14 46.35,17.78 46.35,23.5 45.72,24.13 36.83,24.13 36.19,24.77 36.19,26.67 35.79,27.07 RN1.7

## Copper pours and planes (outline as drawn; the poured copper is in the pictures)
GND on Top Layer: 0,40 85.09,40 85.09,0 0,0
GND on Bottom Layer: 0,40 85.09,40 85.09,0 0,0

## Text on the board
Bottom Silkscreen Layer: Version 0.1 / Designed by Wells Wang, / geek-logic.com, 2025. | UARTAI
Top Silkscreen Layer: 32 | 34 | 35 | ESP32 | 4 | GND | 3V3 | SDA | SCL | SWITCH | CS | CLK | MISO | MOSI | RX | TX | 33 | FLASH | EN | AMS1117 | POWER | MAX3232 | 5V | CH340C | Version 0.1 / Designed by Wells Wang, / geek-logic.com, 2025. | UARTAI
